# EAGLE design BLDC_schematic_v15_MILESTONE (EAGLE 9.6.2)
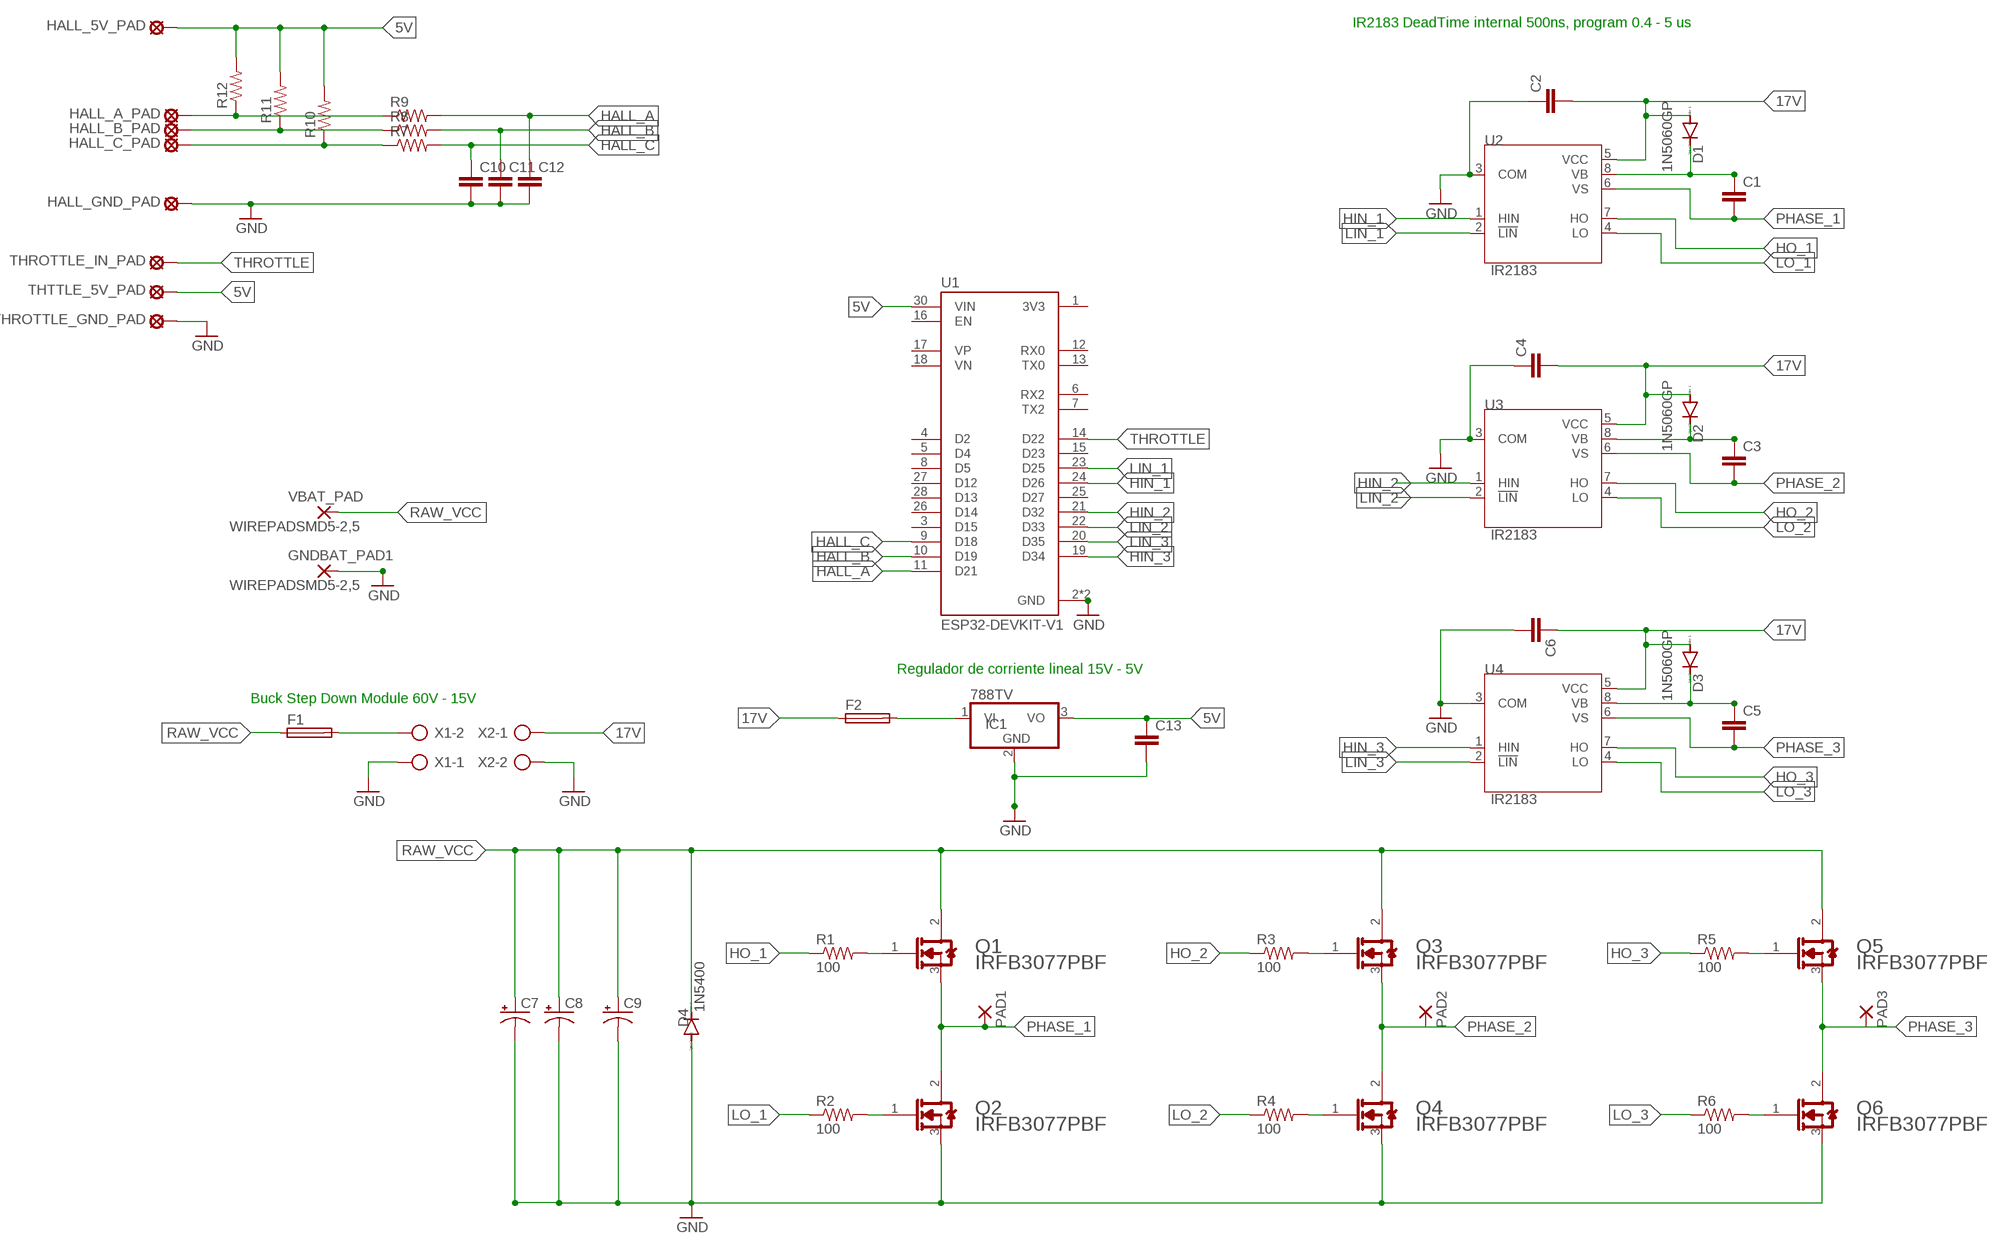
[diagram p0: schematic, sheet 1]

## Parts
C1  C-EU025-030X050  [C025-030X050]
C2  C-EU025-030X050  [C025-030X050]
C3  C-EU025-030X050  [C025-030X050]
C4  C-EU025-030X050  [C025-030X050]
C5  C-EU025-030X050  [C025-030X050]
C6  C-EU025-030X050  [C025-030X050]
C7  CPOL-USTT5D11  [TT5D11]
C8  CPOL-USTT5D11  [TT5D11]
C9  CPOL-USTT5D11  [TT5D11]
C10  C-EU025-030X050  [C025-030X050]
C11  C-EU025-030X050  [C025-030X050]
C12  C-EU025-030X050  [C025-030X050]
C13  C-EU025-030X050  [C025-030X050]
D1  1N5060GP  [DO15-12]
D2  1N5060GP  [DO15-12]
D3  1N5060GP  [DO15-12]
D4  1N5400  [DO201-15]
F1  SH22,5  [SH22,5]
F2  SH22,5  [SH22,5]
GNDBAT_PAD1  WIREPADSMD5-2,5  [5-2,5]
HALL_5V_PAD  MCS08  [MCS08]
HALL_A_PAD  MCS08  [MCS08]
HALL_B_PAD  MCS08  [MCS08]
HALL_C_PAD  MCS08  [MCS08]
HALL_GND_PAD  MCS08  [MCS08]
IC1  788TV  [TO220V]
PAD1  SMD5  [SMD2,54-5,08]
PAD2  SMD5  [SMD2,54-5,08]
PAD3  SMD5  [SMD2,54-5,08]
Q1  INFINEON_IRFB3077PBFINFINEON_IRFB3077PBF_0_0  [INFINEON_IRFB3077PBF_0]
Q2  INFINEON_IRFB3077PBFINFINEON_IRFB3077PBF_0_0  [INFINEON_IRFB3077PBF_0]
Q3  INFINEON_IRFB3077PBFINFINEON_IRFB3077PBF_0_0  [INFINEON_IRFB3077PBF_0]
Q4  INFINEON_IRFB3077PBFINFINEON_IRFB3077PBF_0_0  [INFINEON_IRFB3077PBF_0]
Q5  INFINEON_IRFB3077PBFINFINEON_IRFB3077PBF_0_0  [INFINEON_IRFB3077PBF_0]
Q6  INFINEON_IRFB3077PBFINFINEON_IRFB3077PBF_0_0  [INFINEON_IRFB3077PBF_0]
R1  100  R-US_0207/10  [0207/10]
R2  100  R-US_0207/10  [0207/10]
R3  100  R-US_0207/10  [0207/10]
R4  100  R-US_0207/10  [0207/10]
R5  100  R-US_0207/10  [0207/10]
R6  100  R-US_0207/10  [0207/10]
R7  R-US_0204/7  [0204/7]
R8  R-US_0204/7  [0204/7]
R9  R-US_0204/7  [0204/7]
R10  R-US_0204/7  [0204/7]
R11  R-US_0204/7  [0204/7]
R12  R-US_0204/7  [0204/7]
THROTTLE_GND_PAD  MCS08  [MCS08]
THROTTLE_IN_PAD  MCS08  [MCS08]
THTTLE_5V_PAD  MCS08  [MCS08]
U1  ESP32-DEVKIT-V1  [MODULE_ESP32_DEVKIT_V1]
U2  IR2183  [DIP762W45P254L1092H533Q8]
U3  IR2183  [DIP762W45P254L1092H533Q8]
U4  IR2183  [DIP762W45P254L1092H533Q8]
VBAT_PAD  WIREPADSMD5-2,5  [5-2,5]
X1  AK500/2-H  [AK500/2-H]
X2  AK500/2-H  [AK500/2-H]

## Nets
5V: C13.1 HALL_5V_PAD.MP IC1.3(VO) R10.2 R11.2 R12.2 THTTLE_5V_PAD.MP U1.30(VIN)
17V: C2.2 C4.2 C6.1 D1.A D2.A D3.A F2.1 U2.5(VCC) U3.5(VCC) U4.5(VCC) X2.1
GND: C2.1 C4.1 C6.2 C7.- C8.- C9.- C10.2 C11.2 C12.2 C13.2 D4.A GNDBAT_PAD1.1(P) HALL_GND_PAD.MP IC1.2(GND) Q2.3(S) Q4.3(S) Q6.3(S) THROTTLE_GND_PAD.MP U1.2(GND) U1.29(GND) U2.3(COM) U3.3(COM) U4.3(COM) X1.1 X2.2
HALL_A: C12.1 R9.2 U1.11(D21)
HALL_B: C11.1 R8.2 U1.10(D19)
HALL_C: C10.1 R7.2 U1.9(D18)
HIN_1: U1.24(D26) U2.1(HIN)
HIN_2: U1.21(D32) U3.1(HIN)
HIN_3: U1.19(D34) U4.1(HIN)
HO_1: R1.1 U2.7(HO)
HO_2: R3.1 U3.7(HO)
HO_3: R5.1 U4.7(HO)
LIN_1: U1.23(D25) U2.2(!LIN)
LIN_2: U1.22(D33) U3.2(!LIN)
LIN_3: U1.20(D35) U4.2(!LIN)
LO_1: R2.1 U2.4(LO)
LO_2: R4.1 U3.4(LO)
LO_3: R6.1 U4.4(LO)
N$1: C3.1 D2.C U3.8(VB)
N$2: C5.1 D3.C U4.8(VB)
N$3: C1.1 D1.C U2.8(VB)
N$5: F1.2 X1.2
N$6: Q3.1(G) R3.2
N$7: Q1.1(G) R1.2
N$8: Q2.1(G) R2.2
N$9: Q4.1(G) R4.2
N$11: Q5.1(G) R5.2
N$12: Q6.1(G) R6.2
N$13: F2.2 IC1.1(VI)
N$14: HALL_A_PAD.MP R9.1 R12.1
N$15: HALL_B_PAD.MP R8.1 R11.1
N$16: HALL_C_PAD.MP R7.1 R10.1
PHASE_1: C1.2 PAD1.1(P) Q1.3(S) Q2.2(D) U2.6(VS)
PHASE_2: C3.2 PAD2.1(P) Q3.3(S) Q4.2(D) U3.6(VS)
PHASE_3: C5.2 PAD3.1(P) Q5.3(S) Q6.2(D) U4.6(VS)
RAW_VCC: C7.+ C8.+ C9.+ D4.C F1.1 Q1.2(D) Q3.2(D) Q5.2(D) VBAT_PAD.1(P)
THROTTLE: THROTTLE_IN_PAD.MP U1.14(D22)
Unconnected: U1.1(3V3) U1.3(D15) U1.4(D2) U1.5(D4) U1.6(RX2) U1.7(TX2) U1.8(D5) U1.12(RX0) U1.13(TX0) U1.15(D23) U1.16(EN) U1.17(VP) U1.18(VN) U1.25(D27) U1.26(D14) U1.27(D12) U1.28(D13)

## Notes on the sheet
- IR2183 DeadTime internal 500ns, program 0.4 - 5 us
- Regulador de corriente lineal 15V - 5V
- Buck Step Down Module 60V - 15V

## Library data of the parts
C1-C6 C10-C13 = rcl:C-EU: CAPACITOR, European symbol; SPICEPREFIX: C
C7-C9 = rcl:CPOL-US: POLARIZED CAPACITOR, American symbol; SPICEPREFIX: C
D1-D3 = diode:1N5060GP: DIODE controlled avalanche rectifier
D4 = diode:1N5400: DIODE standard rectifier, 3 A, 50 V (Motorola)
F1 F2 = fuse:SH22,5: FUSE HOLDER grid 22,5 mm, OGN0031 8201, Schurter (Buerklin); MF: SCHURTER; MPN: 0031.8201; OC_FARNELL: 1162740; OC_NEWARK: 96F8317
GNDBAT_PAD1 VBAT_PAD = wirepad:WIREPAD: Wire PAD connect wire on PCB
HALL_5V_PAD HALL_A_PAD HALL_B_PAD HALL_C_PAD HALL_GND_PAD THROTTLE_GND_PAD THROTTLE_IN_PAD THTTLE_5V_PAD = solpad:MCS08: SOLDER PAD MC S0,8, drill 1.2 mm, distributor Buerklin, 08F130
IC1 = linear:78*: Positive VOLTAGE REGULATOR Source: http://cache.national.com/ds/LM/LM78L05.pdf http://www.fairchildsemi.com/ds/LM/LM7805.pdf
PAD1-PAD3 = wirepad:SMD5: SMD PAD
Q1-Q6 = Infineon - IRFB3077PBF:INFINEON_IRFB3077PBF: N-Channel 75 V 120A (Tc) 370W (Tc) Through Hole TO-220AB; AUTOMOTIVE: No; CENTROID_NOT_SPECIFIED: No; CONTINUOUS_DRAIN_CURRENT: 210A; DATASHEET: https://www.infineon.com/dgdl/Infineon-IRFB3077-DataSheet-v01_01-EN.pdf?fileId=5546d462533600a4015356153f0d1def; DEPLETION_MODE: False; DEVICE_CLASS_L1: Discrete Semiconductors; DEVICE_CLASS_L2: Transistors; DEVICE_CLASS_L3: MOSFETs; DIGIKEY_DESCRIPTION: MOSFET N-CH 75V 120A TO220AB; DIGIKEY_PART_NUMBER: IRFB3077PBF-ND; DRAIN_TO_SOURCE_BREAKDOWN_VOLTAGE: 75V; DRAIN_TO_SOURCE_RESISTANCE: 2.8mΩ; DRAIN_TO_SOURCE_VOLTAGE: 75V; FOOTPRINT_URL: https://www.infineon.com/cms/en/product/packages/PG-TO220/PG-TO220-3-904/; FOOTPRINT_VARIANT_NAME_0: Recommended_Land_Pattern; GATE_CHARGE_AT_VGS: 160nC @ 10V; GATE_TO_SOURCE_VOLTAGE: 20V; HEIGHT: 19.15mm; INPUT_CAPACITACE_AT_VDS: 9400pF @ 50V; LEAD_FREE: Yes; MAX_FORWARD_DIODE_VOLTAGE: 1.3V; MAX_JUNCTION_TEMP: +175°C; MF: Infineon; MFG_PACKAGE_IDENT: PG-TO220-3; MFG_PACKAGE_IDENT_COMPONENT_ID: 23a5373a371ebf18; MFG_PACKAGE_IDENT_DATE: 0; MFG_PACKAGE_IDENT_REV: 904; MOUSER_PART_NUMBER: 942-IRFB3077PBF; MPN: IRFB3077PBF; NUMBER_OF_CHANNELS: 1; NUMBER_OF_N_CHANNELS: 1; PACKAGE: TO-220AB; POWER_DISSIPATION: 370W; PREFIX: Q; PULSE_DRAIN_CURRENT: 850A; REVERSE_RECOVERY_CHARGE: 59nC; REVERSE_RECOVERY_TIME: 42ns; ROHS: Yes; RTHJA_MAX: 62°C/W; STANDOFF_HEIGHT: 3.56mm; TECHNOLOGY: NA; TEMPERATURE_RANGE_HIGH: +175°C; TEMPERATURE_RANGE_LOW: -55°C; THRESHOLD_VGS_MAX: 4V; THRESHOLD_VGS_MIN: 2V; TURN_OFF_DELAY_TIME: 69ns; TURN_ON_DELAY_TIME: 25ns; VERIFICATION_VERSION: 0.0.0.3
R1-R12 = rcl:R-US_: RESISTOR, American symbol; SPICEPREFIX: R
U1 = ESP32-DEVKIT-V1:ESP32-DEVKIT-V1: Dual core, Wi-Fi: 2.4 GHz up to 150 Mbits/s,BLE (Bluetooth Low Energy) and legacy Bluetooth, 32 bits, Up to 240 MHz Check availability <https://pricing.snapeda.com/parts/ESP32-DEVKIT-V1/Do%20it/view-part?ref=eda>; AVAILABILITY: Not in stock; DESCRIPTION: Dual core, Wi-Fi: 2.4 GHz up to 150 Mbits/s,BLE (Bluetooth Low Energy) and legacy Bluetooth, 32 bits, Up to 240 MHz; MF: Do it; MP: ESP32-DEVKIT-V1; PACKAGE: None; PRICE: None
U2-U4 = IR2183:IR2183: MOSFET DRVR 600V 2.3A 2-OUT Hi/Lo Side Half Brdg Inv/Non-Inv 8-Pin PDIP Check availability <https://pricing.snapeda.com/parts/IR2183/Infineon/view-part?ref=eda>; AVAILABILITY: In Stock; DESCRIPTION: Half-Bridge Gate Driver IC Inverting, Non-Inverting 14-SOIC; MF: Infineon; MP: IR2183; PACKAGE: DIP-8 International Rectifier; PRICE: None; PURCHASE-URL: https://pricing.snapeda.com/search/part/IR2183/?ref=eda
X1 X2 = con-ptr500:AK500/2-H: CONNECTOR Aug. 2004 / PTR Meßtechnik: Die Bezeichnung der Serie AK505 wurde geändert. Es handelt sich hierbei um AK500 in horizontaler Ausführung.; OC_FARNELL: unknown; OC_NEWARK: unknown

## Module HOLE
Ports: 

### Library data of the parts

## Net classes
0 default: clearance 0.205 mm

## Board
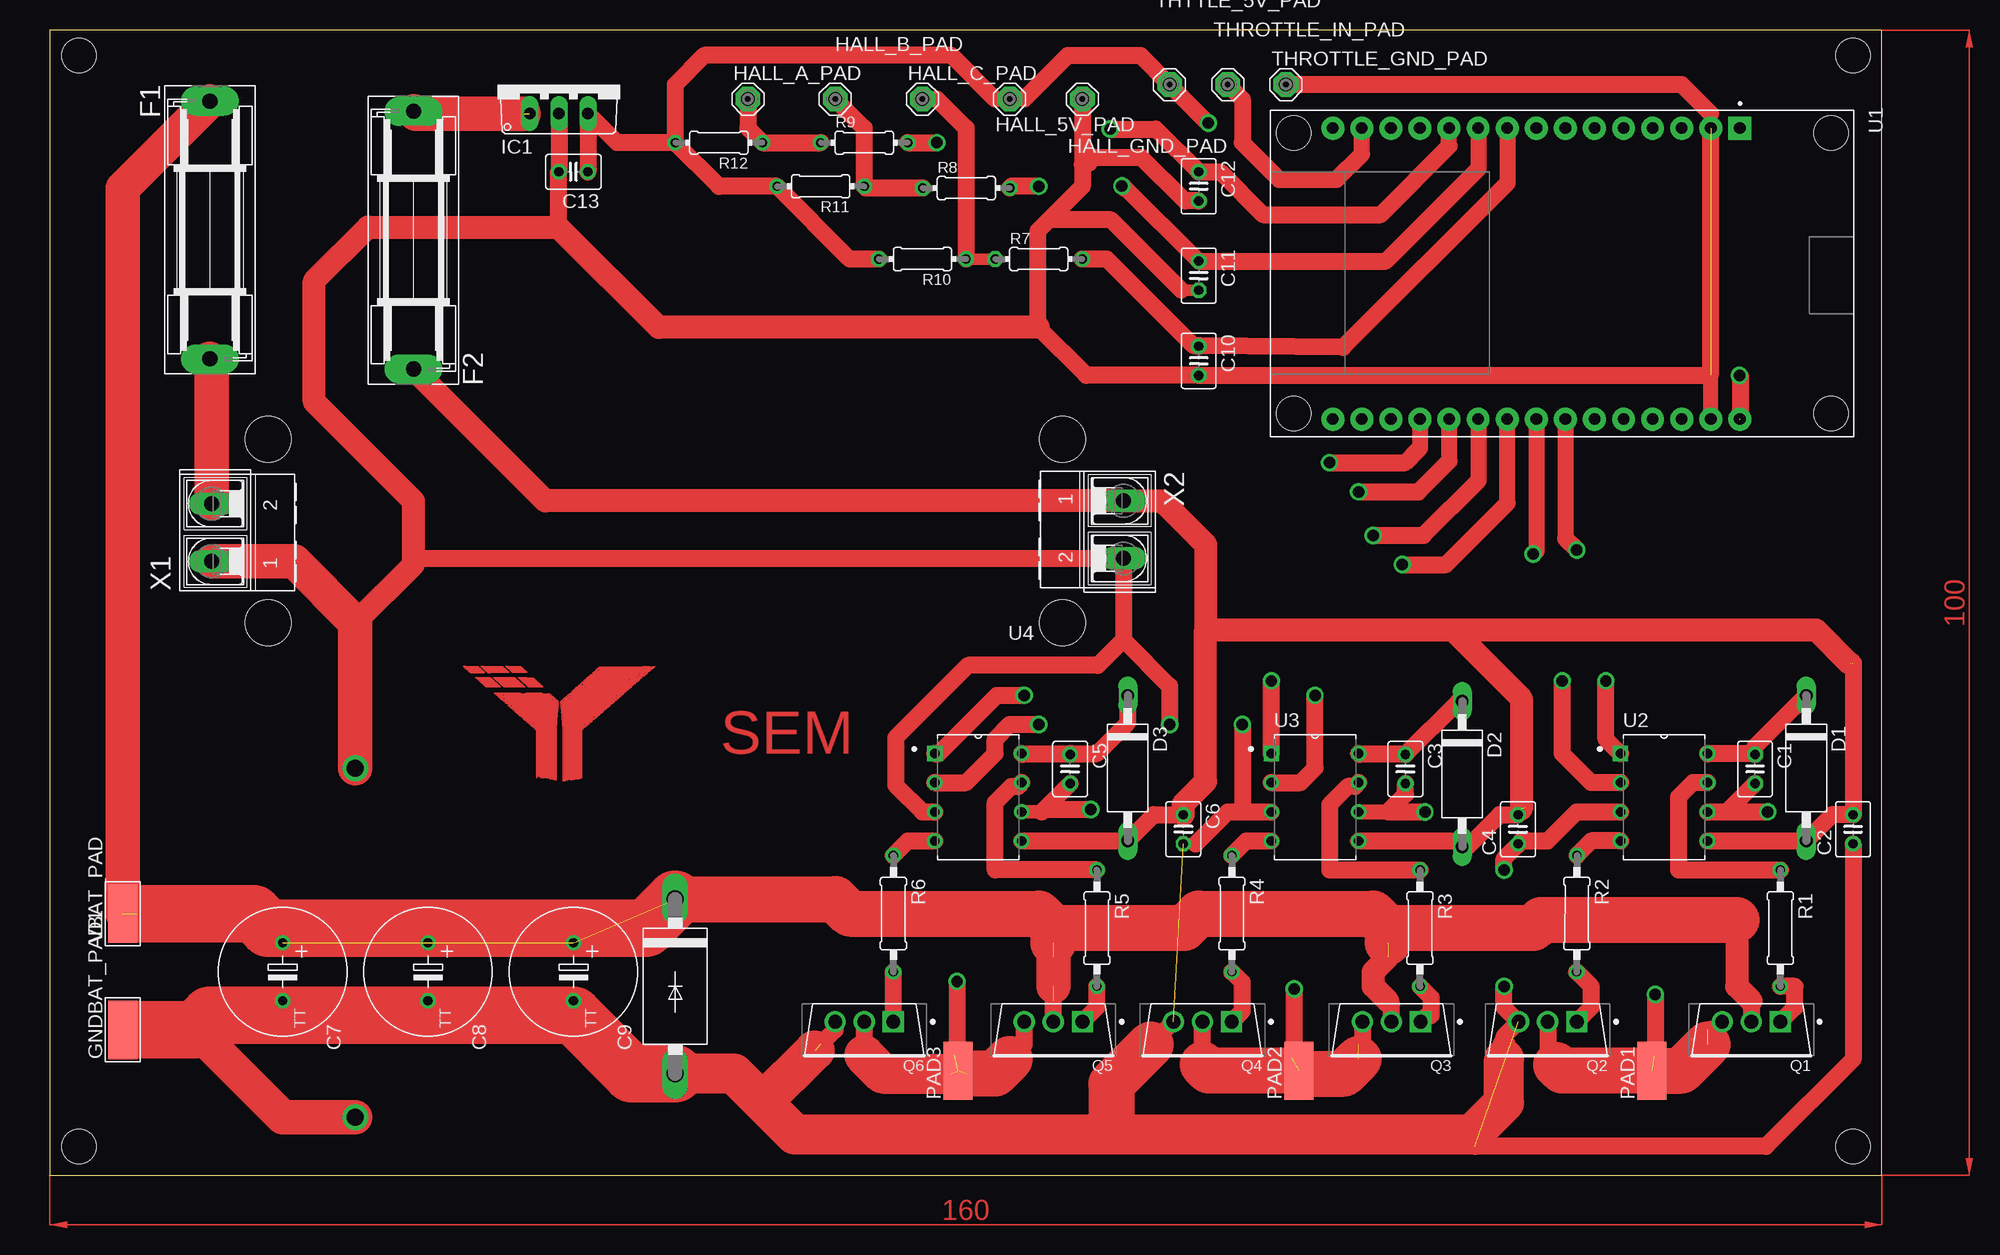
[diagram p1: board, top side]
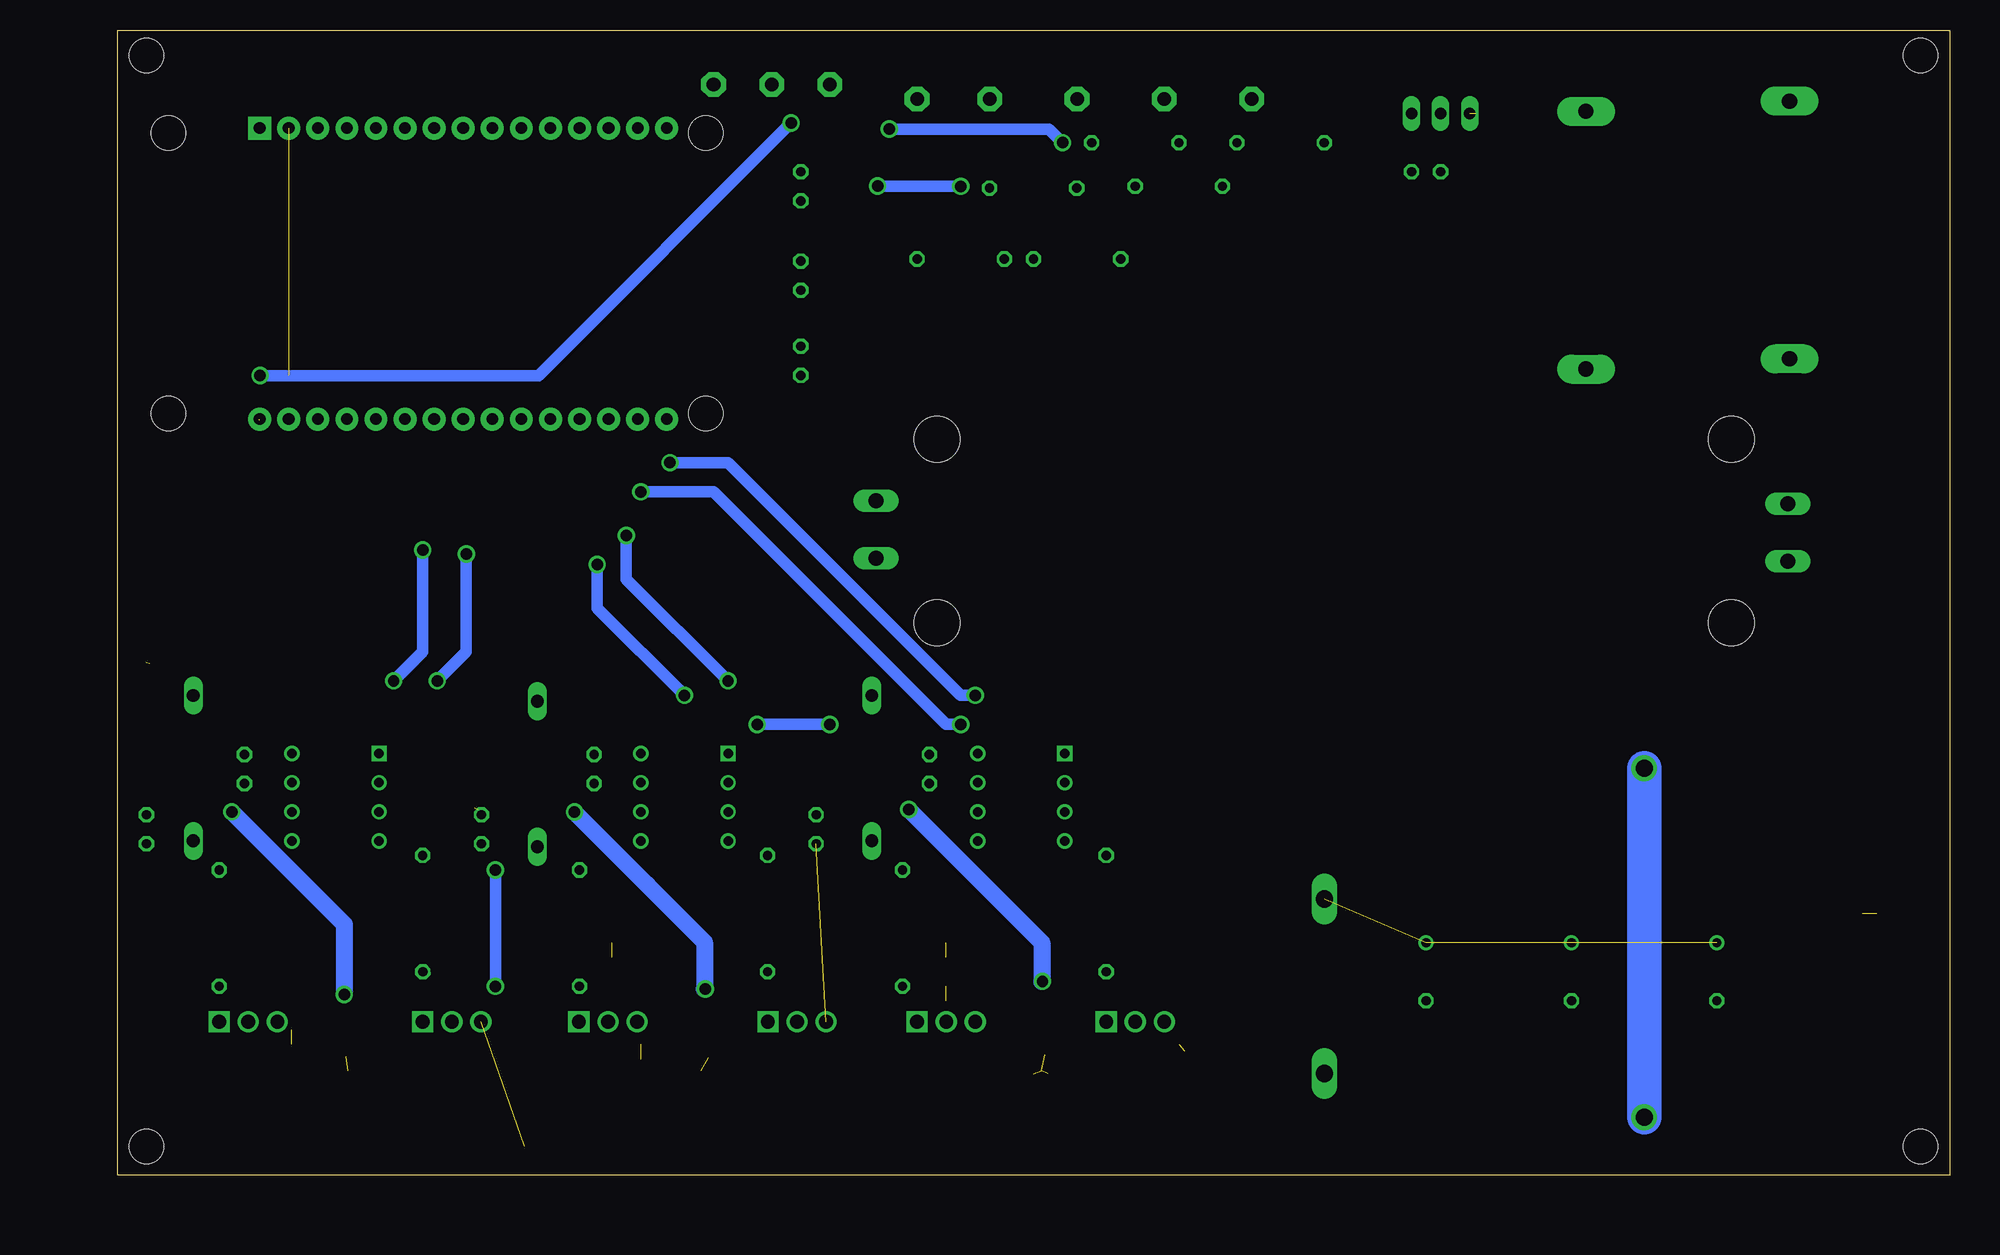
[diagram p2: board, bottom side, seen from below]

Size 160 x 100 mm. Coordinates in mm from the lower left corner, seen from the top.
Outline: 0,0 160,0 160,100 0,100 0,0
Copper layers (1*16): Top 0.035mm / dielectric 1.5mm / Bottom 0.035mm
Design rules "BLDC_schematic_v14 *": minimum track width 0.8mm, minimum drill 0.35mm, track to track 0.8mm, track to pad 0.8mm, pad to pad 0.205mm, via to via 0.205mm, smd to smd 6mil, copper to edge 40mil, drill to drill 6mil, minimum pad ring 10mil, minimum via ring 8mil, stop-mask expansion 4mil, vias tented up to drill 0mil, thermal gap 10mil
Holes 3 mm at 2.54,2.54 2.54,97.79 157.48,2.54 157.48,97.79
Holes 4 mm at 19.05,48.26 19.05,64.26 88.45,48.26 88.45,64.26

### Footprints (pad centres in the part's own frame; a part is rotated, then mirrored left to right if it is on the bottom)
C025-030X050 = drill 0.813 octagon: 1 -1.27,0; 2 1.27,0
TT5D11 = drill 0.813: + -2.54,0 | drill 0.813 octagon: - 2.54,0
DO15-12 = drill 1.118 long: A 6.35,0; C -6.35,0
DO201-15 = drill 1.499 long: A 7.62,0; C -7.62,0
SH22,5 = drill 1.321 pad 2.54 long: 1 -11.252,0; 2 11.252,0
5-2,5 = smd 2.54 x 5.08: 1 0,0
MCS08 = drill 1.194 pad 2.159 octagon: MP 0,0
TO220V = drill 1.016 long: 1 -2.54,-2.54; 2 0,-2.54; 3 2.54,-2.54
SMD2,54-5,08 = smd 2.54 x 5.08: 1 0,0
INFINEON_IRFB3077PBF_0 = drill 1.2 pad 1.85 square: 1 -0.705,2.54 | drill 1.2 pad 1.85: 2 -0.705,0; 3 -0.705,-2.54
0207/10 = drill 0.813 octagon: 1 -5.08,0; 2 5.08,0
0204/7 = drill 0.813 octagon: 1 -3.81,0; 2 3.81,0
MODULE_ESP32_DEVKIT_V1 = drill 1.02 pad 2 square: 1 -12.7,15.515 | drill 1.02 pad 2: 2 -12.7,12.975; 3 -12.7,10.435; 4 -12.7,7.895; 5 -12.7,5.355; 6 -12.7,2.815; 7 -12.7,0.275; 8 -12.7,-2.265; 9 -12.7,-4.805; 10 -12.7,-7.345; 11 -12.7,-9.885; 12 -12.7,-12.425; 13 -12.7,-14.965; 14 -12.7,-17.505; 15 -12.7,-20.045; 16 12.7,-20.045; 17 12.7,-17.505; 18 12.7,-14.965; 19 12.7,-12.425; 20 12.7,-9.885; 21 12.7,-7.345; 22 12.7,-4.805; 23 12.7,-2.265; 24 12.7,0.275; 25 12.7,2.815; 26 12.7,5.355; 27 12.7,7.895; 28 12.7,10.435; 29 12.7,12.975; 30 12.7,15.515 | hole 3: -12.28,-23.475; 12.23,-23.475; 12.23,23.475; -12.28,23.475
DIP762W45P254L1092H533Q8 = drill 0.83 square: 1 -3.81,3.81 | drill 0.83: 2 -3.81,1.27; 3 -3.81,-1.27; 4 -3.81,-3.81; 5 3.81,-3.81; 6 3.81,-1.27; 7 3.81,1.27; 8 3.81,3.81
AK500/2-H = drill 1.321 long: 1 -2.515,0; 2 2.515,0

### Placement (x,y rotation side)
C1  148.92,35.48 270 top
C2  157.48,30.23 90 top
C3  118.39,35.48 270 top
C4  128.22,30.23 90 top
C5  89.1,35.48 270 top
C6  98.98,30.23 270 top
C7  20.32,17.78 270 top
C8  33.02,17.78 270 top
C9  45.72,17.78 270 top
C10  100.33,71.12 270 top
C11  100.33,78.56 270 top
C12  100.33,86.36 270 top
C13  45.72,87.63 180 top
D1  153.39,35.56 270 top
D2  123.34,35.05 270 top
D3  94.13,35.56 270 top
D4  54.61,16.51 270 top
F1  13.97,82.55 270 top
F2  31.75,81.66 90 top
GNDBAT_PAD1  6.35,12.7 0 top
HALL_5V_PAD  83.82,93.98 0 top
HALL_A_PAD  60.96,93.98 0 top
HALL_B_PAD  68.58,93.98 0 top
HALL_C_PAD  76.2,93.98 0 top
HALL_GND_PAD  90.17,93.98 0 top
IC1  44.45,95.25 0 top
PAD1  139.9,9.14 0 top
PAD2  109.07,9.14 0 top
PAD3  79.3,9.14 0 top
Q1  148.59,12.7 270 top
Q2  130.81,12.7 270 top
Q3  117.17,12.7 270 top
Q4  100.66,12.7 270 top
Q5  87.63,12.7 270 top
Q6  71.12,12.7 270 top
R1  151.13,21.59 270 top
R2  133.35,22.86 269.9 top
R3  119.66,21.59 270 top
R4  103.23,22.86 270 top
R5  91.44,21.59 270 top
R6  73.66,22.86 270 top
R7  86.36,80.01 0 top
R8  80.04,86.21 0 top
R9  71.12,90.17 0 top
R10  76.2,80.01 180 top
R11  67.31,86.36 180 top
R12  58.42,90.17 180 top
THROTTLE_GND_PAD  107.95,95.25 0 top
THROTTLE_IN_PAD  102.87,95.25 0 top
THTTLE_5V_PAD  97.79,95.25 0 top
U1  132.08,78.74 270 top
U2  140.97,33.02 0 top
U3  110.49,33.02 0 top
U4  81.08,33.02 0 top
VBAT_PAD  6.35,22.86 0 top
X1  14.12,56.13 90 top
X2  93.75,56.39 270 top

### Tracks (layer width: path | path; a pad name or v marks a point on that pad's centre or on a via)
5V  (via drill 1)  (1 unrouted)
  Top 1: 82.55,93.98 HALL_5V_PAD.MP 85.09,93.98 | 101.07,91.97 101.17,91.97 v101.17,91.9
  Top 1.5: R12.2 49.53,90.17 IC1.3 C13.1 | R12.2 58.42,86.36 R11.2 69.85,80.01 R10.2 | 82.55,93.98 78.74,97.79 57.15,97.79 54.61,95.25 R12.2 | 85.09,93.98 88.9,97.79 95.25,97.79 THTTLE_5V_PAD.MP 101.07,91.97 | v147.55,69.85 147.65,69.75 147.65,65.96
  Bottom 1: v101.17,91.9 123.24,69.83 147.55,69.83 v147.55,69.85
17V  (2 unrouted)
  Top 1.5: 157.5,44.76 157.5,31.52 C2.2 155.68,31.5 D1.A U2.5 | 128.8,32.08 C4.2 126.62,31.5 123.83,28.7 D2.A 122.83,29.21 U3.5 | U4.5 D3.A 96.42,31.5 C6.1
  Top 2: 100.94,47.62 100.94,55.09 97.13,58.9 X2.1 43.26,58.9 F2.1 | 100.94,47.62 100.94,34.39 98.98,32.44 C6.1 | 100.94,47.62 122.53,47.62 | 128.5,31.98 128.5,41.66 122.53,47.62 | 122.53,47.62 154.25,47.62 157.2,44.68
GND  (via drill 1, 1.5)  (4 unrouted)
  Top 1: C6.2 100.08,28.96 | 128.47,29.21 C4.1 128.27,28.91 | C10.2 100.14,69.66 | U1.2 145.06,92.71 | C11.2 98.81,77.29
  Top 1.2: 90.17,88.27 90.55,88.27
  Top 1.3: U1.29 145.06,69.85 | 145,91.39 U1.2
  Top 1.5: 127,11.43 127,12.13 Q2.3 127,14.68 v127,16.51 | Q4.3 96.14,11.43 95.25,11.43 | 31.75,53.34 32.28,53.87 X2.2 93.75,46.76 | U4.3 76.2,31.75 73.86,34.09 73.86,38.2 80.19,44.53 91.52,44.53 93.75,46.76 | 104.14,31.75 102.87,31.75 100.08,28.96 | 104.14,31.75 U3.3 | 93.75,46.76 97.79,42.72 v97.79,39.37 | 128.47,29.21 130.81,29.21 133.35,31.75 U2.3 | v104.14,39.37 104.14,31.75 | C2.1 157.48,10.16 149.86,2.54 124.46,2.54 | v127,26.67 127,27.64 128.27,28.91 | HALL_GND_PAD.MP 90.17,88.27 90.17,86.36 87.25,83.44 | 87.25,83.44 86.31,82.5 86.31,74.07 90.53,69.85 C10.2 145,69.85 145,91.39 | 145.06,92.71 142.51,95.25 THROTTLE_GND_PAD.MP | 90.55,88.27 91.16,88.88 95.35,88.88 99.14,85.09 C12.2 | 87.25,83.44 92.66,83.44 98.81,77.29 | Q6.3 68.58,12.7 67.31,11.43 | IC1.2 C13.2 44.4,87.58 44.4,82.8
  Top 2: 127,10.16 127,11.43 | GNDBAT_PAD1.1 7.62,13.97 13.97,13.97 | C7.- C8.- C9.- 52.07,8.89 D4.A | 26.67,48.26 31.75,53.34 31.75,58.88 23.09,67.54 23.09,78.11 27.79,82.8 44.4,82.8 53.19,74.02 53.24,74.07 86.31,74.07
  Top 3: X1.1 21.31,53.62 26.67,48.26 v26.67,35.56 | v26.67,5.08 20.32,5.08 12.7,12.7
  Top 3.5: D4.A 59.74,8.89 62.26,6.38 | 127,10.16 127,6.35 124.21,3.56 65.08,3.56 62.26,6.38 | 62.26,6.38 66.78,10.9 66.8,10.9
  Top 4: 96.14,11.43 92.71,8 92.71,5.08
  Top 5: D4.A 50.8,8.89 45.72,13.97 13.97,13.97 12.7,12.7 7.62,12.7
  Bottom 1: v104.14,39.37 v97.79,39.37 | v127,16.51 v127,26.67
  Bottom 3: v26.67,35.56 v26.67,5.08
HALL_A  (via drill 1)
  Top 1.4: 122.2,89.86 U1.11
  Top 1.5: v92.61,91.36 96.6,91.36 C12.1 102.21,87.63 105.94,83.9 116.23,83.9 122.2,89.86 | R9.2 v77.47,90.17
  Bottom 1: v92.61,91.36 78.66,91.36 v77.47,90.17
HALL_B  (via drill 1)
  Top 1: C11.1 100.45,79.89
  Top 1.4: 93.88,86.13 v93.62,86.39 93.78,86.39 C11.1 | U1.10 124.73,87.91 124.74,87.91
  Top 1.5: R8.2 84.02,86.39 86.33,86.39 v86.36,86.36 | 124.74,87.91 116.66,79.83 C11.1 100.33,79.86 | 93.67,86.33 v93.62,86.39
  Bottom 1: v93.62,86.39 86.39,86.39 v86.36,86.36
HALL_C
  Top 1: C10.1 100.28,72.44
  Top 1.4: U1.9 127.28,86.64
  Top 1.5: R7.2 92.3,80.01 99.87,72.44 100.28,72.44 | C10.1 100.38,72.44 112.93,72.29 127.28,86.64
HIN_1  (via drill 1)
  Top 1.4: U1.24 132.35,55.6 132.36,55.6
  Top 1.5: U2.1 135.89,38.1 v135.89,43.18 | 132.36,55.6 v133.35,54.61
  Bottom 1: v135.89,43.18 133.35,45.72 v133.35,54.61
HIN_2  (via drill 1)
  Top 1.4: U1.21 124.73,60.66 124.74,60.66
  Top 1.5: U3.1 v106.68,43.18 | v115.57,55.88 119.96,55.88 124.74,60.66
  Bottom 1: v106.68,43.18 115.57,52.07 v115.57,55.88
HIN_3  (via drill 1)
  Top 1.4: 119.48,63.35 119.66,63.52 U1.19
  Top 1.5: U4.1 77.62,36.83 82.7,41.91 v85.09,41.91 | v111.76,62.23 118.36,62.23 119.48,63.35
  Bottom 1: v85.09,41.91 86.36,41.91 106.68,62.23 v111.76,62.23
HO_1
  Top 1.5: U2.7 144.73,34.29 144.72,34.3 143.5,34.3 142.24,33.03 142.24,26.67 R1.1
HO_2
  Top 1.5: U3.7 113.98,33.97 113.38,33.97 111.76,32.35 111.76,26.67 R3.1
HO_3
  Top 1.5: R5.1 82.55,26.67 82.55,32.55 83.97,33.97 84.57,33.97 U4.7
LIN_1  (via drill 1)
  Top 1.4: U1.23 129.81,54.53 v129.54,54.25
  Top 1.5: U2.2 134.62,34.29 132.08,36.83 v132.08,43.18 | v129.54,54.25 129.82,54.53
  Bottom 1: v132.08,43.18 129.54,45.72 v129.54,54.25
LIN_2  (via drill 1)
  Top 1.4: 127.28,58.7 U1.22
  Top 1.5: U3.2 109.22,34.29 110.49,35.56 v110.49,41.91 | v118.11,53.34 121.92,53.34 127.28,58.7
  Bottom 1: v110.49,41.91 118.11,49.53 v118.11,53.34
LIN_3  (via drill 1)
  Top 1.4: U1.20 122.19,62.36 122.2,62.36
  Top 1.5: U4.2 80.01,34.29 82.55,36.83 82.55,38.1 83.82,39.37 v86.36,39.37 | v114.3,59.69 119.53,59.69 122.2,62.36
  Bottom 1: v86.36,39.37 87.63,39.37 107.95,59.69 v114.3,59.69
LO_1
  Top 1.5: U2.4 134.62,29.21 R2.1
LO_2
  Top 1.5: R4.1 104.5,29.21 U3.4
LO_3
  Top 1.5: R6.1 74.93,29.21 U4.4
N$1
  Top 1.5: U3.8 114.38,36.75 C3.1 123.04,41.4 D2.C
N$2
  Top 1.5: U4.8 84.96,36.75 C5.1 89.18,36.83 91.44,36.83 94.13,39.52 D3.C
N$3
  Top 1.5: D1.C 148.92,37.44 C1.1 148.87,36.8 144.81,36.8 U2.8
N$5
  Top 3: F1.2 14.12,71.14 X1.2
N$6
  Top 1.5: Q3.1 120.28,13.97 120.65,13.97 120.65,15.52 R3.2
N$7
  Top 1.5: Q1.1 152.4,14.68 152.4,16.51 R1.2
N$8
  Top 1.5: Q2.1 134.62,14.68 134.62,16.51 R2.2
N$9
  Top 1.5: Q4.1 104.14,14.35 104.14,16.87 R4.2
N$11
  Top 1.5: Q5.1 91.44,14.68 R5.2
N$12
  Top 1.5: Q6.1 R6.2
N$13  (1 unrouted)
  Top 3: 41.39,92.71 31.95,92.71 F2.2
N$14
  Top 1.5: R9.1 R12.1 60.96,91.44 HALL_A_PAD.MP
N$15
  Top 1.5: R8.1 71.27,86.21 R11.1 71.12,91.44 HALL_B_PAD.MP
N$16
  Top 1: R10.1 R7.1 | 77.47,93.98 HALL_C_PAD.MP
  Top 1.5: R10.1 80.01,91.44 77.47,93.98
PHASE_1  (via drill 1)  (2 unrouted)
  Top 1.5: 131.56,9.64 130.81,10.39 Q2.2 | Q1.3 145.34,12.7 144.78,12.7 | C1.2 146.46,31.75 | U2.6 146.46,31.75 | 146.46,31.75 149.99,31.75 150.01,31.73 v150.03,31.74 | v140.21,15.8 140.21,10.49 140.08,10.36
  Top 4: 144.78,11.43 142.49,9.14 PAD1.1 132.06,9.14 131.56,9.64
  Bottom 1.5: v150.03,31.74 143.43,25.15 140.21,21.92 v140.21,15.8
PHASE_2  (via drill 1)  (2 unrouted)
  Top 1.3: U3.6 116.86,31.75
  Top 1.5: 100.66,9.7 Q4.2 | Q3.3 114.63,11.76 114.3,11.43 | C3.2 118.39,33.27 116.86,31.75 120.07,31.75 v120.09,31.73 | v108.66,16.28 108.66,10.49 108.43,10.26
  Top 4: 114.3,10.16 113.03,8.89 109.32,8.89 PAD2.1 101.22,9.14 100.66,9.7
  Bottom 1.5: v120.09,31.73 113.75,25.39 108.74,20.37 108.74,16.28 v108.66,16.28
PHASE_3  (via drill 1)  (3 unrouted)
  Top 1: 85.09,11.43 83.82,10.16
  Top 1.2: 86.64,31.75 U4.6
  Top 1.5: Q6.2 71.12,10.49 | C5.2 86.87,31.98 | 86.87,31.98 86.64,31.75 | Q5.3 85.09,11.43 | 86.87,31.98 90.88,31.98 v90.91,31.95 | v79.22,16.94 79.22,10.77 78.99,10.54
  Top 3.5: 71.12,10.49 72.72,8.89 78.74,8.89
  Top 4: 83.82,10.16 82.55,8.89 80.01,8.89
  Bottom 1.5: v90.91,31.95 79.27,20.32 79.27,16.94 v79.22,16.94
RAW_VCC  (7 unrouted)
  Top 1.5: Q3.2 117.17,14.91 116.84,15.24 | 148.59,15.24 Q1.2 | Q5.2 87.63,15.24
  Top 2: 116.84,15.24 115.57,16.51 115.57,17.78 116.84,19.05 | 147.32,22.3 147.32,16.51 148.59,15.24
  Top 3: 87.63,16.51 87.63,19.05 | VBAT_PAD.1 6.35,86.18 F1.1
  Top 4: D4.C 68.58,24.13 69.85,22.86 86.36,22.86 87.63,21.59 | 116.84,21.59 115.57,22.86 100.33,22.86 99.06,21.59 87.63,21.59 | 116.84,21.59 129.54,21.59 130.25,22.3 147.32,22.3 | 116.84,21.59 116.84,20.32 | 87.63,21.59 87.63,20.32
  Top 5: D4.C 52.07,21.59 19.05,21.59 17.78,22.86 7.62,22.86
THROTTLE
  Top 1.4: 114.58,89.17 U1.14
  Top 1.5: THROTTLE_IN_PAD.MP 104.14,93.98 104.14,90.17 107.34,86.97 112.37,86.97 114.58,89.17
(copper drawn outside any net)
  shapes: Top area x1577

### Text on the board
Top: SEM
Bottom: C:/Users/fernando/Pictures/Escul/logonormal.bmp
200bmp: C:/Users/fernando/Downloads/Capture (1).bmp
204bmp: C:/Users/fernando/Downloads/Capture (1).bmp
207bmp: C:/Users/fernando/Downloads/Capture (1).bmp